# EasyEDA Pro project ProPrj_esp32s31-mp4_2026-09-21.epro, board PCB1
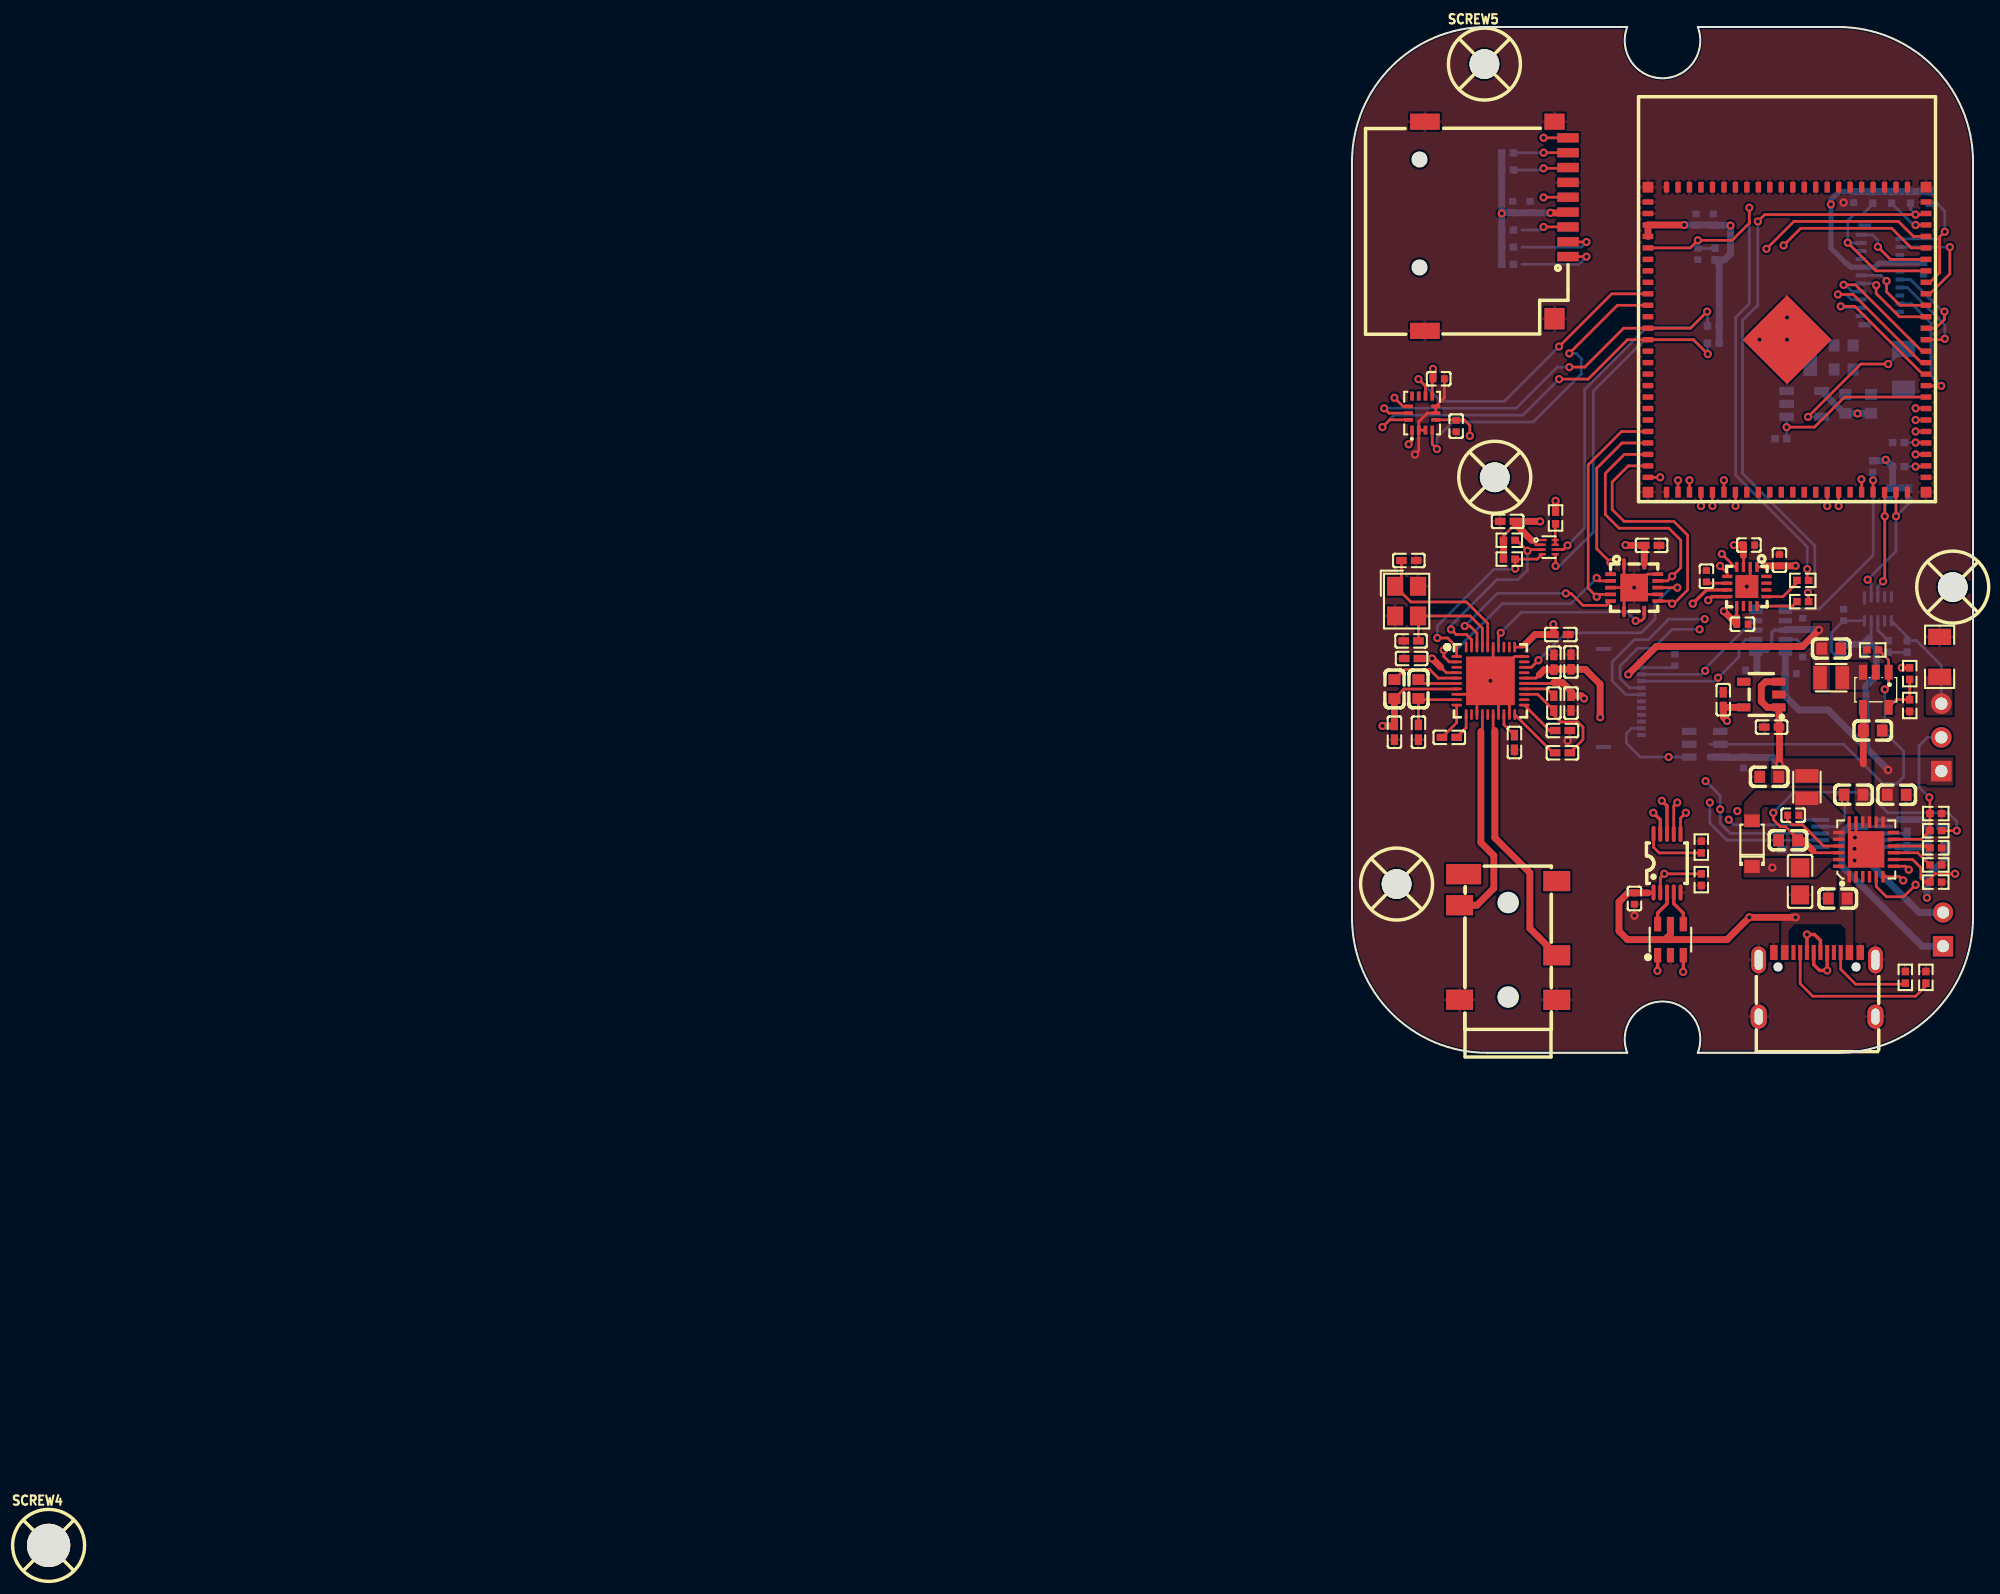
[diagram p10: board, top side]
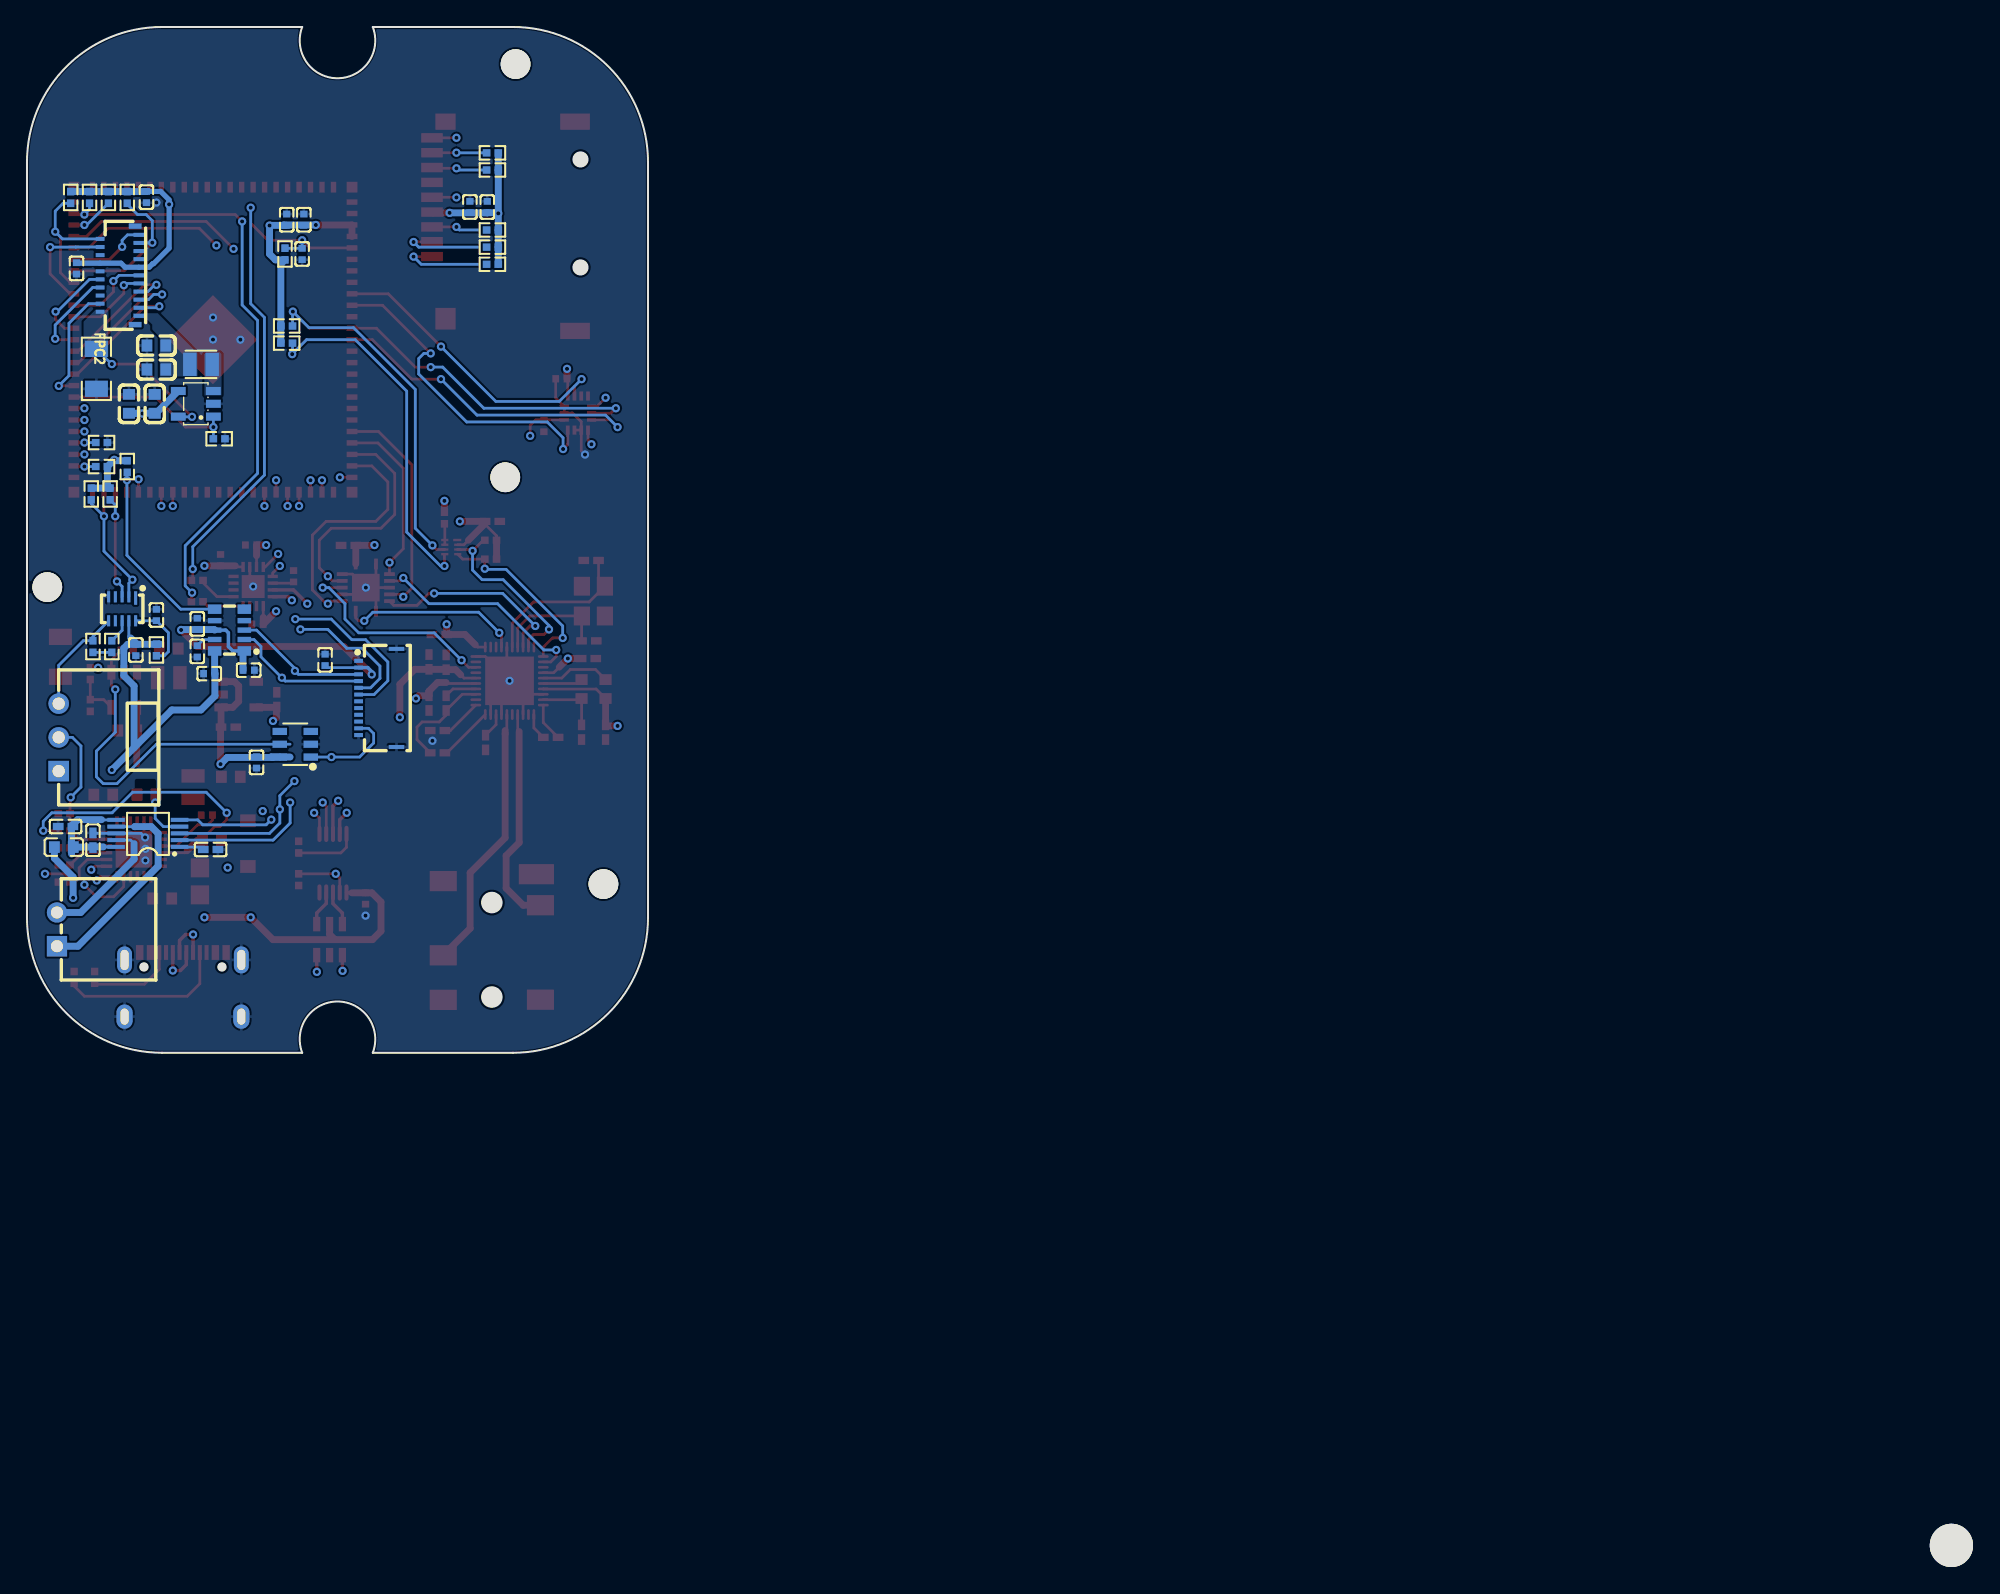
[diagram p11: board, bottom side, seen from below]

Outline 46 x 76 mm; copper layers: Top Layer, GND1, PWR, SINGAL, GND2, Bottom Layer. Coordinates in mm from the lower left corner of the outline.
Outline path: 0,66 arc(2.93,73.07) 10,76 20.38,76 arc(23,72.2) 25.62,76 36,76 arc(43.07,73.07) 46,66 46,10 arc(43.07,2.93) 36,0 25.62,0 arc(23,3.8) 20.38,0 10,0 arc(2.93,2.93) 0,10 0,66
Stack: Top Layer 0.035mm Outer layer thickness 1oz / Dielectric1 0.0994mm 3313 RC57% 4.2mil / GND1 0.035mm / Dielectric2 0.55mm 0.55mm H/H No copper / PWR 0.035mm / Dielectric3 0.1088mm 2116 RC54% 4.9mil / SINGAL 0.035mm / Dielectric4 0.55mm 0.55mm H/H No copper / GND2 0.035mm / Dielectric5 0.0994mm 3313 RC57% 4.2mil / Bottom Layer 0.035mm Outer layer thickness 1oz

## Design rules (mm)
net TYPEC_USB_DP_IN: USB1
net TYPEC_USB_DN_IN: USB1
net TYPEC_USB_DN: USB2
net TYPEC_USB_DP: USB2
net CH343P_USB_DP: USB3
net CH343P_USB_DN: USB3
spacing copperThickness1oz (default): track to track 0.102, other pairs 0.152 to 0.3
spacing copperThickness2oz: track to track 0.203, other pairs 0.152 to 0.3
track width copperThickness1oz (default): min 0.127, default 0.203, max 2.54
track width copperThickness2oz: min 0.203, default 0.254, max 2.54
track width power: min 0.127, default 0.508, max 2.54
differential pair differentialPair (default): width min 0.127, default 0.254, max 2.54; gap min 0.152, default 0.152
net GND uses copperRegion
net VBAT uses power
net VCC uses power
net VCC_3V3 uses power
net VCC_1V8 uses power
net VBUS_5V uses power
net VCC_LCD_BG uses power

## Placement (name value [footprint] x y rotation side)
C1  10uF  [C0603_1]  38.57 23.88 180 top
C2  10uF  [C0603_1]  35.5 29.95 180 top
C3  100nF  [C0402]  29 21.51 90 bottom
C4  1uF  [C0402_1]  32.4 15.06 0 bottom
C5  1uF  [C0402_1]  41.11 15.75 270 bottom
C6  100nF  [C0402]  29.58 28.35 180 bottom
C7  100nF  [C0402]  32.5 28.09 0 bottom
C8  22uF  [C0603]  3.14 26.95 270 top
C9  4.7uF  [C0603_1]  32.3 15.75 180 top
C10  10uF  [C0603_1]  40.35 19.12 180 top
C11  47nF  [C0402]  32.68 17.6 0 top
C12  10uF  [C0603_1]  30.9 20.45 0 top
C14  1uF  [C0603_1]  35.98 11.43 0 top
C15  10uF  [C0603_1]  37.15 19.12 0 top
C16  47uF  [C0805]  33.19 12.7 270 top
C17  2.2uF  [C0402_1]  3.14 23.75 270 top
C18  22uF  [C0603]  4.92 26.95 270 top
C19  2.2uF  [C0402_1]  4.92 23.75 270 top
C20  2.2uF  [C0402_1]  7.2 23.37 0 top
C21  2.2uF  [C0402_1]  15.59 23.88 0 top
C22  2.2uF  [C0402_1]  12.03 22.99 270 top
C23  2.2uF  [C0402_1]  16.22 25.91 90 top
C24  2.2uF  [C0402_1]  14.95 25.91 270 top
C25  2.2uF  [C0402_1]  15.59 22.22 0 top
C26  4.7uF  [C0402_1]  14.95 28.93 90 top
C27  100nF  [C0402_1]  15.46 30.99 0 top
C28  100nF  [C0402_1]  4.41 29.21 180 top
C29  100nF  [C0402_1]  16.22 28.96 90 top
C30  1uF  [C0402_1]  31.08 24.13 0 top
C31  1uF  [C0402_1]  27.5 26.16 270 top
C32  10pF  [C0402_1]  4.21 36.47 180 top
C33  10pF  [C0402_1]  4.37 30.52 180 top
C34  100nF  [C0402_1]  11.52 39.37 180 top
C35  100nF  [C0402_1]  22.19 37.59 180 top
C36  100nF  [C0402]  20.92 11.43 270 top
C37  100nF  [C0402]  31.66 36.5 90 top
C38  100nF  [C0402]  26.25 35.31 90 top
C39  1uF  [C0402]  25.62 59.18 270 bottom
C40  100nF  [C0402]  26.76 61.72 90 bottom
C41  1uF  [C0402]  25.49 61.72 90 bottom
C42  10uF  [C0603_1]  36.41 52.4 180 bottom
C43  220nF  [C0402]  37.94 29.84 270 bottom
C44  100nF  [C0402]  29.4 37.62 0 top
C45  100nF  [C0402]  42.33 58.11 270 bottom
C46  100nF  [C0402]  37.15 63.4 270 bottom
C47  100nF  [C0402]  7.71 46.43 270 top
C48  100nF  [C0402]  6.42 49.94 0 top
C49  10uF  [C0402]  11.9 62.66 270 bottom
C50  100nF  [C0402]  13.19 62.67 270 bottom
C51  100nF  [C0402]  28.92 31.75 0 top
C53  100nF  [C0402]  33.39 31.77 90 bottom
C54  1uF  [C0402]  33.39 29.74 270 bottom
C55  10uF  [C0603_1]  36.41 50.62 180 bottom
C56  10uF  [C0603_1]  38.45 48.08 270 bottom
C57  10uF  [C0603_1]  36.54 48.08 270 bottom
C58  100nF  [C0402_1]  43.15 16.76 180 bottom
C59  100nF  [C0402]  23.92 29.11 90 bottom
C61  220nF  [C0402]  36.41 32.44 90 bottom
CARD2  TF PUSH  [TF-SMD_TF-PUSH]  10.7 61.24 270 top
CN1  PJ-342B-TX-SMT  [AUDIO-SMD_PJ-342B-TX-SMT]  11.56 8.57 90 top
CN2  HX-XH2.54-3PWZ-B  [CONN-TH_3P-P2.50_BX-HA2.54-3PWZ]  43.65 23.37 90 bottom
CN3  HX-XH2.54-2PWZ-B  [CONN-TH_2P-P2.50_HX-XH2.54-2PWZ-B]  43.78 9.14 90 bottom
D1  USBLC6-2SC6  [SOT-23-6_L2.9-W1.6-P0.95-LS2.8-BL]  23.59 8.38 0 top
D2  B5817W  [SOD-123_L2.8-W1.8-LS3.7-RD]  29.63 15.49 90 top
FPC1  HC-FPC-05-10-12RLTAG  [FPC-SMD_12P-P0.50_HCTL_HC-FPC-05-10-12RLTAG]  20.03 26.29 270 bottom
FPC2  2.09寸320*375高清R角方屏QSPI  [CONN-TH-21P_AFE03-S21FMA-1H]  39.15 57.6 90 bottom
L1  2.2uH  [IND-SMD_L2.0-W1.6]  35.5 27.79 0 top
L2  2.2uH  [IND-SMD_L2.0-W1.6]  33.7 19.68 270 top
L3  BLM18KG601SN1D  [L0603]  43.27 15.24 0 bottom
L4  4.7uH  [IND-SMD_L2.0-W1.6]  33.11 51 180 bottom
R1  10mΩ  [R1206]  43.53 29.34 90 top
R2  1K  [R0402]  36.41 29.84 90 bottom
R3  22K1  [R0402]  41.31 25.73 90 top
R4  100K  [R0402]  41.31 28.09 90 top
R5  100K  [R0402]  38.57 29.84 0 top
R7  10K  [R0402]  39.84 41.4 270 bottom
R8  10K  [R0402]  41.24 41.4 270 bottom
R9  700R  [R0402]  43.24 15.19 180 top
R11  100K  [R0402]  43.24 13.91 180 top
R12  100K  [R0402]  43.24 12.64 180 top
R13  5K23  [R0402]  43.24 16.45 180 top
R14  30K1  [R0402]  43.24 17.72 180 top
R17  200K  [R0402_2]  15.08 39.62 90 top
R18  10K  [R0402_1]  11.65 37.97 180 top
R19  10K  [R0402_1]  11.65 36.58 180 top
R20  10K  [R0402]  41.37 63.37 270 bottom
R21  100K  [R0402]  25.87 15.24 270 top
R22  100K  [R0402]  25.87 12.83 270 top
R25  10K  [R0402]  39.97 63.37 270 bottom
R26  10K  [R0402]  26.76 53.85 180 bottom
R27  0/NC  [R0402]  33.39 35 0 top
R28  0/NC  [R0402]  33.39 33.43 180 top
R29  10K  [R0402]  26.89 59.18 270 bottom
R30  10K  [R0402]  26.76 52.58 180 bottom
R31  5K1  [R0402]  42.51 5.59 270 top
R32  5K1  [R0402]  40.99 5.59 270 top
R33  1K  [R0402]  39.72 30.1 270 bottom
R34  0R  [R0402]  41.11 30.1 270 bottom
R35  10K  [R0402]  11.52 66.67 0 bottom
R36  10K  [R0402]  11.52 58.42 0 bottom
R37  10K  [R0402]  11.52 59.69 0 bottom
R38  10K  [R0402]  11.52 65.4 0 bottom
R39  10K  [R0402]  11.52 60.96 0 bottom
R40  1R5  [R1206]  40.86 50.67 90 bottom
R41  100K  [R0402]  31.77 45.49 0 bottom
R42  10K  [R0402]  38.57 43.43 90 bottom
R43  10K  [R0402]  40.48 43.43 0 bottom
R44  10K  [R0402]  40.48 45.21 0 bottom
R45  10K  [R0402]  38.57 63.37 270 bottom
R46  10K  [R0402]  42.76 63.37 270 bottom
SCREW1  -  [M3螺丝]  3.3 12.5 0 top
SCREW2  -  [M3螺丝]  10.57 42.64 0 top
SCREW3  -  [M3螺丝]  44.5 34.5 0 top
SCREW4  -  [M3螺丝#2]  -96.56 -36.5 0 top
SCREW5  -  [M3螺丝]  9.81 73.25 0 top
U1  RX8130CE:BB  [RTC-SMD_L3.2-W2.5-P0.7-RX8130CE]  31 31.32 0 bottom
U2  CS43131-CNZ  [QFN-40_L5.0-W5.0-P0.40-TL-EP3.6_1]  10.25 27.56 0 top
U3  BQ25895RTW  [WQFN-24_L4.0-W4.0-P0.50-TL-EP2.7]  38.08 15.07 90 top
U4  TLV62568DBVR  [SOT-23-5_L3.0-W1.7-P0.95-LS2.8-BR]  38.8 26.9 90 top
U5  ME6211C18M5G-N  [SOT-23-5_L3.0-W1.7-P0.95-LS2.8-BR_1]  30.32 26.54 0 top
U6  GEK100  [SOT-23-6_L2.9-W1.6-P0.95-LS2.8-BL-2]  26.13 22.86 90 bottom
U7  PCA9306DQER  [X2SON-8_L1.4-W1.0-P0.35-BL]  14.57 37.46 270 top
U8  SN74LV4T125RGYR  [VQFN-14_L3.5-W3.5-P0.50-BL-EP]  20.9 34.46 270 top
U9  ESP32-S31-WROOM-3-N16R16V  [CONN-SMD_ESP32-S31-WROOM-3]  32.22 52.83 0 top
U11  DRV2605LDGSR  [VSSOP-10_L3.0-W3.0-P0.50-LS4.9-BL]  37.05 16.26 90 bottom
U12  CH343P  [TQFN-16_L3.0-W3.0-P0.50-BL-EP1.7]  29.25 34.54 180 top
U14  STC3115AIQT  [DFN-10_L3.0-W2.0-P0.50-BL]  38.95 32.89 0 bottom
U15  LSM6DS3TR-C  [LGA-14_L3.0-W2.5-P0.50-TL]  5.19 47.39 90 top
U16  PAM2804AAB010  [SOT-23-5_L3.0-W1.7-P0.95-LS2.8-BR]  33.49 48.08 180 bottom
U17  SGM7229YMS10G/TR  [MSOP-10_L3.0-W3.0-P0.50-LS4.9-BL]  23.33 14.05 0 top
USB1  TYPE-C 16PIN 2MD(073)  [USB-C-SMD_TYPE-C-16PIN-2MD-073]  34.45 5.05 0 top
X1  26MHz  [CRYSTAL-SMD_4P-L3.2-W2.5-BL_1]  4.04 33.46 270 top

## Footprints (pads in the part's own frame, mm; a bottom-side part is the same pattern mirrored in y, then rotated)
AUDIO-SMD_PJ-342B-TX-SMT
  rect 1.5x2 smd: 2(-4.645,3.6) 3(2.355,3.6) 5(-4.655,-3.6) 6(-1.355,-3.6) 7(4.145,-3.6)
  rect 1.5x2.6 smd: 4(4.655,3.3)
C0402
  rect 0.5x0.54 smd: 1(-0.42,0) 2(0.42,0)
C0402_1
  rect 0.79x0.54 smd: 1(-0.545,0) 2(0.545,0)
C0603
  rect 0.8x0.9 smd: 1(-0.7,0) 2(0.7,0)
C0603_1
  rect 0.8x0.9 smd: 1(-0.7,0) 2(0.7,0)
C0805
  rect 1.41x1.35 smd: 1(-1,0) 2(1,0)
CONN-SMD_ESP32-S31-WROOM-3
  rect 0.8x0.4 smd: 1(-10.3,10.2) 2(-10.3,9.35) 3(-10.3,8.5) 4(-10.3,7.65) 5(-10.3,6.8) 6(-10.3,5.95) 7(-10.3,5.1) 8(-10.3,4.25) 9(-10.3,3.4) 10(-10.3,2.55) 11(-10.3,1.7) 12(-10.3,0.85) 13(-10.3,0) 14(-10.3,-0.85) 15(-10.3,-1.7) 16(-10.3,-2.55) 17(-10.3,-3.4) 18(-10.3,-4.25) 19(-10.3,-5.1) 20(-10.3,-5.95) 21(-10.3,-6.8) 22(-10.3,-7.65) 23(-10.3,-8.5) 24(-10.3,-9.35) 25(-10.3,-10.2) 48(10.3,-10.2) 49(10.3,-9.35) 50(10.3,-8.5) 51(10.3,-7.65) 52(10.3,-6.8) 53(10.3,-5.95) 54(10.3,-5.1) 55(10.3,-4.25) 56(10.3,-3.4) 57(10.3,-2.55) 58(10.3,-1.7) 59(10.3,-0.85) 60(10.3,0) 61(10.3,0.85) 62(10.3,1.7) 63(10.3,2.55) 64(10.3,3.4) 65(10.3,4.25) 66(10.3,5.1) 67(10.3,5.95) 68(10.3,6.8) 69(10.3,7.65) 70(10.3,8.5) 71(10.3,9.35) 72(10.3,10.2)
  rect 0.4x0.8 smd: 26(-8.925,-11.3) 27(-8.075,-11.3) 28(-7.225,-11.3) 29(-6.375,-11.3) 30(-5.525,-11.3) 31(-4.675,-11.3) 32(-3.825,-11.3) 33(-2.975,-11.3) 34(-2.125,-11.3) 35(-1.275,-11.3) 36(-0.425,-11.3) 37(0.425,-11.3) 38(1.275,-11.3) 39(2.125,-11.3) 40(2.975,-11.3) 41(3.825,-11.3) 42(4.675,-11.3) 43(5.525,-11.3) 44(6.375,-11.3) 45(7.225,-11.3) 46(8.075,-11.3) 47(8.925,-11.3) 73(8.925,11.3) 74(8.075,11.3) 75(7.225,11.3) 76(6.375,11.3) 77(5.525,11.3) 78(4.675,11.3) 79(3.825,11.3) 80(2.975,11.3) 81(2.125,11.3) 82(1.275,11.3) 83(0.425,11.3) 84(-0.425,11.3) 85(-1.275,11.3) 86(-2.125,11.3) 87(-2.975,11.3) 88(-3.825,11.3) 89(-4.675,11.3) 90(-5.525,11.3) 91(-6.375,11.3) 92(-7.225,11.3) 93(-8.075,11.3) 94(-8.925,11.3)
  custom 6.604x6.604 smd: 95(0,3.302)
  rect 0.8x0.8 smd: 96(-10.3,-11.3) 97(10.3,-11.3) 98(10.3,11.3) 99(-10.3,11.3)
CONN-TH-21P_AFE03-S21FMA-1H
  rect 0.3x0.8 smd: 1(-3,-1.438) 3(-2.4,-1.438) 5(-1.8,-1.438) 7(-1.2,-1.438) 9(-0.6,-1.438) 11(0,-1.438) 13(0.6,-1.438) 15(1.2,-1.438) 17(1.8,-1.438) 19(2.4,-1.438) 21(3,-1.438)
  rect 0.3x0.65 smd: 2(-2.7,1.438) 4(-2.1,1.438) 6(-1.5,1.438) 8(-0.9,1.438) 10(-0.3,1.438) 12(0.3,1.438) 14(0.9,1.438) 16(1.5,1.438) 18(2.1,1.438) 20(2.7,1.438)
  rect 0.4x0.95 smd: 22(3.65,-1.163) 23(-3.65,-1.163)
CONN-TH_2P-P2.50_HX-XH2.54-2PWZ-B
  rect 1.524x1.5 hole 0.9: 1(-1.25,0)
  round 1.5 hole 0.9: 2(1.25,0)
CONN-TH_3P-P2.50_BX-HA2.54-3PWZ
  rect 1.524x1.524 hole 0.914: 1(-2.5,0)
  round 1.524 hole 0.914: 2(0,0) 3(2.5,0)
CRYSTAL-SMD_4P-L3.2-W2.5-BL_1
  rect 1.4x1.2 smd: 1(-1.1,-0.85) 2(1.1,-0.85) 3(1.1,0.85) 4(-1.1,0.85)
DFN-10_L3.0-W2.0-P0.50-BL
  rect 0.23x1 smd: 1(-1,-0.8)
  rect 0.23x0.825 smd: 2(-0.5,-0.887) 3(0,-0.887) 4(0.5,-0.887) 5(1,-0.887) 6(1,0.887) 7(0.5,0.887) 8(0,0.887) 9(-0.5,0.887) 10(-1,0.887)
FPC-SMD_12P-P0.50_HCTL_HC-FPC-05-10-12RLTAG
  rect 0.3x0.65 smd: 1(-2.75,-1.405) 2(-2.25,-1.405) 3(-1.75,-1.405) 4(-1.25,-1.405) 5(-0.75,-1.405) 6(-0.25,-1.405) 7(0.25,-1.405) 8(0.75,-1.405) 9(1.25,-1.405) 10(1.75,-1.405) 11(2.25,-1.405) 12(2.75,-1.405)
  rect 0.3x1.15 smd: 13(3.635,1.405) 14(-3.635,1.405)
IND-SMD_L2.0-W1.6
  rect 1x1.72 smd: 1(0.828,0) 2(-0.828,0)
L0603
  rect 0.8x0.864 smd: 1(-0.7,0) 2(0.7,0)
LGA-14_L3.0-W2.5-P0.50-TL
  rect 0.675x0.28 smd: 1(-1.262,0.75) 2(-1.262,0.25) 3(-1.262,-0.25) 4(-1.262,-0.75) 8(1.262,-0.75) 9(1.262,-0.25) 10(1.262,0.25) 11(1.262,0.75)
  rect 0.28x0.675 smd: 5(-0.5,-1.012) 6(0,-1.012) 7(0.5,-1.012) 12(0.5,1.012) 13(0,1.012) 14(-0.5,1.012)
M3螺丝
  round 2.2 hole 2.2: 1(0,0)
M3螺丝#2
  round 3.2 hole 3.2: 1(0,0)
MSOP-10_L3.0-W3.0-P0.50-LS4.9-BL
  oval 0.3x1.2 smd: 1(-1,-2.17) 2(-0.5,-2.17) 3(0,-2.17) 4(0.5,-2.17) 5(1,-2.17) 6(1,2.17) 7(0.5,2.17) 8(0,2.17) 9(-0.5,2.17) 10(-1,2.17)
QFN-40_L5.0-W5.0-P0.40-TL-EP3.6_1
  oval 0.8x0.2 smd: 1(-2.499,1.8) 2(-2.499,1.4) 3(-2.499,1) 4(-2.499,0.6) 5(-2.499,0.2) 6(-2.499,-0.2) 7(-2.499,-0.6) 8(-2.499,-1) 9(-2.499,-1.4) 10(-2.499,-1.8) 21(2.499,-1.8) 22(2.499,-1.4) 23(2.499,-1) 24(2.499,-0.6) 25(2.499,-0.2) 26(2.499,0.2) 27(2.499,0.6) 28(2.499,1) 29(2.499,1.4) 30(2.499,1.8)
  oval 0.2x0.8 smd: 11(-1.8,-2.499) 12(-1.4,-2.499) 13(-1,-2.499) 14(-0.6,-2.499) 15(-0.2,-2.499) 16(0.2,-2.499) 17(0.6,-2.499) 18(1,-2.499) 19(1.4,-2.499) 20(1.8,-2.499) 31(1.8,2.499) 32(1.4,2.499) 33(1,2.499) 34(0.6,2.499) 35(0.2,2.499) 36(-0.2,2.499) 37(-0.6,2.499) 38(-1,2.499) 39(-1.4,2.499) 40(-1.8,2.499)
  rect 3.6x3.6 smd: 41(0,0)
R0402
  rect 0.566x0.54 smd: 1(-0.433,0) 2(0.433,0)
R0402_1
  rect 0.566x0.54 smd: 1(-0.433,0) 2(0.433,0)
R0402_2
  rect 0.566x0.54 smd: 1(-0.433,0) 2(0.433,0)
R1206
  rect 1.208x1.701 smd: 1(-1.479,0) 2(1.479,0)
RTC-SMD_L3.2-W2.5-P0.7-RX8130CE
  rect 1x0.7 smd: 1(-1.1,1.55) 5(-1.1,-1.55) 6(1.1,-1.55) 10(1.1,1.55)
  rect 1x0.4 smd: 2(-1.1,0.7) 3(-1.1,0) 4(-1.1,-0.7) 7(1.1,-0.7) 8(1.1,0) 9(1.1,0.7)
SOD-123_L2.8-W1.8-LS3.7-RD
  rect 0.95x1.15 smd: 1(-1.692,0) 2(1.692,0)
SOT-23-5_L3.0-W1.7-P0.95-LS2.8-BR
  rect 1.1x0.6 smd: 1(1.3,-0.95) 2(1.3,0) 3(1.3,0.95) 4(-1.3,0.95) 5(-1.3,-0.95)
SOT-23-5_L3.0-W1.7-P0.95-LS2.8-BR_1
  rect 1x0.6 smd: 1(1.3,-0.95) 2(1.3,0) 3(1.3,0.95) 4(-1.3,0.95) 5(-1.3,-0.95)
SOT-23-6_L2.9-W1.6-P0.95-LS2.8-BL
  rect 0.532x1.072 smd: 1(-0.95,-1.149) 2(0,-1.149) 3(0.95,-1.149) 4(0.95,1.149) 5(0,1.149) 6(-0.95,1.149)
SOT-23-6_L2.9-W1.6-P0.95-LS2.8-BL-2
  rect 0.532x1.072 smd: 1(-0.95,-1.149) 2(0,-1.149) 3(0.95,-1.149) 4(0.95,1.149) 5(0,1.149) 6(-0.95,1.149)
TF-SMD_TF-PUSH
  rect 0.7x1.6 smd: 1(2.25,5.3) 2(1.15,5.3) 3(0.05,5.3) 4(-1.05,5.3) 5(-2.15,5.3) 6(-3.25,5.3) 7(-4.35,5.3) 8(-5.45,5.3) CD(-6.55,5.3)
  rect 1.2x1.5 smd: 10(-7.75,4.3)
  rect 1.2x2.2 smd: 11(-7.75,-5.3) 12(7.75,-5.3)
  rect 1.6x1.5 smd: 13(6.85,4.3)
TQFN-16_L3.0-W3.0-P0.50-BL-EP1.7
  rect 0.25x0.75 smd: 1(-0.749,-1.45) 2(-0.248,-1.45) 3(0.252,-1.45) 4(0.751,-1.45) 9(0.75,1.45) 10(0.25,1.45) 11(-0.25,1.45) 12(-0.749,1.45)
  rect 0.75x0.25 smd: 5(1.45,-0.75) 6(1.45,-0.25) 7(1.45,0.25) 8(1.45,0.75) 13(-1.45,0.75) 14(-1.45,0.25) 15(-1.45,-0.25) 16(-1.45,-0.75)
  rect 1.7x1.7 smd: 17(0.001,0)
USB-C-SMD_TYPE-C-16PIN-2MD-073
  oval 1.1x2 hole 0.6x1.5: 13(-4.325,1.825) 14(4.325,1.825)
  oval 1.2x1.8 hole 0.6x1.2: 13(-4.325,-2.375) 14(4.325,-2.375)
  rect 0.55x1.1 smd: A1B12(-3.2,2.375) A4B9(-2.4,2.375) B1A12(3.2,2.375) B4A9(2.4,2.375)
  rect 0.3x1.1 smd: A5(-1.25,2.375) A6(-0.25,2.375) A7(0.25,2.375) A8(1.25,2.375) B5(1.75,2.375) B6(0.75,2.375) B7(-0.75,2.375) B8(-1.75,2.375)
VQFN-14_L3.5-W3.5-P0.50-BL-EP
  rect 0.8x0.28 smd: 1(-1.75,-0.75) 7(1.75,-0.75) 8(1.75,0.75) 14(-1.75,0.75)
  rect 0.28x0.8 smd: 2(-0.999,-1.75) 3(-0.498,-1.75) 4(0.002,-1.75) 5(0.501,-1.75) 6(1.002,-1.75) 9(1,1.75) 10(0.5,1.75) 11(0,1.75) 12(-0.5,1.75) 13(-1,1.75)
  rect 2.05x2.05 smd: 15(0,0)
VSSOP-10_L3.0-W3.0-P0.50-LS4.9-BL
  rect 0.3x1.3 smd: 1(-1,-2.35) 2(-0.5,-2.35) 3(0,-2.35) 4(0.5,-2.35) 5(1,-2.35) 6(1,2.35) 7(0.5,2.35) 8(0,2.35) 9(-0.5,2.35) 10(-1,2.35)
WQFN-24_L4.0-W4.0-P0.50-TL-EP2.7
  rect 0.85x0.25 smd: 1(-2.025,1.25) 2(-2.025,0.75) 3(-2.025,0.25) 4(-2.025,-0.25) 5(-2.025,-0.75) 6(-2.025,-1.25) 13(2.025,-1.25) 14(2.025,-0.75) 15(2.025,-0.25) 16(2.025,0.25) 17(2.025,0.75) 18(2.025,1.25)
  rect 0.25x0.85 smd: 7(-1.25,-2.025) 8(-0.75,-2.025) 9(-0.25,-2.025) 10(0.25,-2.025) 11(0.75,-2.025) 12(1.25,-2.025) 19(1.25,2.025) 20(0.75,2.025) 21(0.25,2.025) 22(-0.25,2.025) 23(-0.75,2.025) 24(-1.25,2.025)
  rect 2.7x2.7 smd: 25(0.001,0)
X2SON-8_L1.4-W1.0-P0.35-BL
  rect 0.175x0.6 smd: 1(-0.525,-0.445)
  rect 0.175x0.53 smd: 2(-0.175,-0.48) 3(0.175,-0.48) 4(0.525,-0.48) 5(0.525,0.48) 6(0.175,0.48) 7(-0.175,0.48) 8(-0.525,0.48)

## Nets
As in the schematic, except:
$2N16: C9.1 R13.1 U3.22

Pads without a net: CN1 4 7; FPC1 7 8 9 10; FPC2 6 15 16 22 23; SCREW1 1; SCREW2 1; SCREW3 1; SCREW4 1; SCREW5 1; U1 4 5; U2 3 12 15 22 27 29 32 33 40; U5 4; U6 4; U9 6 7 8 33 34 35 36 37 38 39 91; U12 10 11 14 15 16; U14 4 7; U15 10 11; USB1 A8 B8

## Via types
v1: diameter 0.61, hole 0.305, Top Layer to Bottom Layer, 157 vias

## Routing (per net, layer and track width the routed paths; a pad name or vN(x,y) marks a point on that pad's centre or on a via; arc(x,y) is an arc through that point)
GND: length 41.9
  Top Layer w0.203: U2.13 9.25,26.56 U2.8 ; U8.13 21.9,35.46 v1(20.9,34.46) ; U8.1 20.15,35.21 v1(20.9,34.46) ; U3.17 37.33,16.03 v1(37.25,15.95) 36.83,16.37 U3.18 ; U8.7 20.15,33.71 20.9,34.46 U8.4 ; v1(20.9,34.46) 21.4,33.96 U8.10 ; 4.94,46.13 4.94,46.76 5.58,47.4 6.2,47.4 U15.6 U15.7 6.84,48.53 C48.2 ; 10.45,27.76 v1(10.25,27.56) ; 10.45,27.76 12.05,29.36 U2.30 ; 10.45,27.76 U2.35 ; U12.2 29.5,34.79 v1(29.25,34.54) ; v1(36.5,18.54) 36.5,19.06 C15.1 ; v1(4.66,44.32) 4.94,44.6 U15.2 U15.3 ; U2.17 10.85,26.96 11.65,26.16 U2.19
  Bottom Layer w0.203: U11.4 35.9,16.76 36.5,17.36 v1(36.5,18.54) ; C5.1 41.08,16.26 U11.8 37.56,16.26 v1(37.25,15.95)
  vias: v1(15.97,23.11) v1(20.92,10.16) v1(30.19,52.83) v1(32.22,54.48) v1(32.22,52.84) v1(36.41,62.99) v1(37.23,15.11) v1(37.23,14.25)
VBAT: length 25.7
  Top Layer w0.508: 39.66,20.93 39.69,20.93 v1(39.72,20.95)
  Bottom Layer w0.203: U14.9 38.45,30.87 38.32,30.73
  Bottom Layer w0.508: 38.06,22.61 38.06,27.18 38.83,27.94 38.83,29.97 38.53,30.26 C43.1 36.17,30.26 36.16,30.28 ; 38.06,22.61 v1(39.72,20.95) ; 38.06,22.61 35.27,25.4 33.11,25.4 32.08,26.43 C7.1 32.1,28.11 U1.10 ; 38.32,30.73 37.89,30.31
VBUS_5V: length 59.3
  Top Layer w0.203: 28.5,32.5 U12.9 ; U12.3 29,36.83
  Top Layer w0.254: 22.33,11.88 22.31,11.85 21.94,11.85
  Top Layer w0.508: 23.18,8.38 23.59,8.78 D1.5 ; 23.18,8.38 20.41,8.38 19.78,9.01 19.78,11.18 20.45,11.85 21.94,11.85 ; 23.18,8.38 27.78,8.38 v1(29.43,10.03) v1(32.86,10.03) ; v1(27.55,32.71) 27.55,32.7 C51.1 28.5,32.26 ; 29,36.83 29,37.58 ; C44.1 v1(28.29,37.62)
  PWR w0.508: v1(28.29,37.62) 28.07,37.84 26.75,37.84 26,37.08 26,35.94 27.55,34.39 v1(27.55,32.71) 27.55,29.31 33.11,23.75 33.11,20.7 29.43,17.02 v1(29.43,10.03)
VCC: length 41.5
  Top Layer w0.203: 13.87,28 13.63,27.76 U2.26
  Top Layer w0.508: v1(31.66,21.39) 31.66,24.09 C30.2 31.62,25.59 U5.1 30.76,25.59 30.32,26.03 30.32,27.18 30.63,27.49 U5.3 ; 37.87,21.4 C1.2 37.87,25.57 U4.4 ; 13.87,28 14.25,28.39 C26.1 14.98,28.41 C29.1 17.27,28.41 18.38,27.3 v1(18.38,24.85)
  PWR w0.508: v1(18.38,24.85) 22.35,24.85 25.82,21.39 v1(31.66,21.39)
  Bottom Layer w0.508: 27.78,21.88 31.17,21.88 v1(31.66,21.39) ; 26.51,21.91 27.88,21.91 27.91,21.93
VCC_1V8: length 100.7
  Top Layer w0.203: 14.95,27.43 14.95,27.36 U2.25 ; C8.2 3.84,26.95 7.74,26.95 U2.7 ; 13.3,37.97 13.63,37.64 U7.2 ; 6.57,28.57 6.99,28.16 U2.4 ; 12.79,30.23 12.62,30.06 U2.31 ; R18.2 11.22,38.3 12.07,39.15
  Top Layer w0.508: 21.65,37.54 U8.14 ; R18.2 R19.2 ; v1(27.78,24.59) 27.52,24.84 27.52,25.59 ; v1(14.91,31.75) C27.1 13.55,30.99 12.79,30.23 ; v1(2.25,24.22) 3.06,24.22 C17.1 C8.2 ; 27.52,25.59 U5.5 ; 27.52,25.59 C31.2 ; v1(13.94,39.37) 12.07,39.37 12.07,39.21 13.3,37.97 ; C35.2 20.28,37.59 v1(20.26,37.62) ; v1(17.19,26.25) 16.98,26.45 C23.2 16.22,26.8 15.59,27.43 14.95,27.43 ; 4.96,29.21 v1(5.93,29.21) 6.57,28.57
  PWR w0.508: v1(17.19,26.25) 14.91,28.52 v1(14.91,31.75) ; v1(17.19,26.25) 26.12,26.25 v1(27.78,24.59) ; v1(17.19,26.25) 15.15,24.22 v1(2.25,24.22) 5.93,27.9 v1(5.93,29.21) 3.27,31.88 3.27,36.83 5.81,39.37 v1(13.94,39.37) 18.51,39.37 v1(20.26,37.62)
VCC_3V3: length 211.7
  Top Layer w0.203: v1(4.19,45.08) 4.44,45.34 U15.1 ; U15.8 5.94,49.81 ; v1(8.73,45.71) 8.73,46.48 8.31,46.89 7.67,46.89 ; 7.67,46.89 U15.5 ; 7.67,46.89 C47.1 ; U12.1 30.44,35.99 ; v1(3.14,48.53) 3.78,47.89 U15.12
  Top Layer w0.254: 41.31,28.52 v1(40.73,28.52)
  Top Layer w0.508: 30.57,36.08 C37.1 v1(32.86,36.08) ; v1(15.08,40.89) R17.2 ; v1(24.6,61.33) U9.3 U9.4 ; v1(20.46,28.03) 22.53,30.1 33.36,30.1 v1(34.59,31.32) ; C48.1 v1(6,50.67) ; CARD2.4 15.94,62.23 v1(14.7,62.23)
  PWR w0.203: v1(34.59,31.32) 37.39,28.52 v1(40.73,28.52) ; v1(4.19,45.08) 4.82,45.72 8.72,45.72 v1(8.73,45.71) ; v1(3.14,48.53) 5.44,48.53 6,49.08 v1(6,50.67)
  PWR w0.508: v1(15.08,40.89) 15.08,48.51 11.09,52.5 ; 9.26,50.67 11.09,52.5 ; 9.26,50.67 8.73,50.14 v1(8.73,45.71) ; 9.26,50.67 v1(6,50.67) ; 11.09,52.5 v1(11.09,62.19) 11.09,63.32 12.03,64.26 25.06,64.26 ; v1(34.59,31.32) 32.86,33.05 v1(32.86,36.08) 37.8,41.02 38.95,41.02 39.53,41.6 v1(39.53,43.93) 34.76,48.7 34.76,62.15 v1(35.47,62.86) 34.07,64.26 25.06,64.26 ; 25.06,64.26 v1(28.03,61.29)
  Bottom Layer w0.203: C59.1 23.77,28.54 21.44,28.54 FPC1.2
  Bottom Layer w0.254: U1.8 31.28,31.32 31.08,31.11 31.08,30.1 30.75,29.77 U1.1 ; FPC1.2 20.76,28.54 20.46,28.24 v1(20.46,28.03)
  Bottom Layer w0.381: 42.23,58.56 42.17,58.5 FPC2.14 39.03,58.5 38.73,58.2 FPC2.13 36.95,58.2 36.69,58.46 36.63,58.46 35.47,59.61 v1(35.47,62.86) 35.47,63.19 36.1,63.82 C46.1
  Bottom Layer w0.508: R42.2 39.61,43.87 R43.1 40.05,42.04 R7.1 R8.1 ; R36.1 R37.1 R39.1 v1(11.09,62.19) ; U1.8 32.14,31.35 C53.1 34.56,31.35 v1(34.59,31.32) ; 27.02,61.3 26.99,61.33 v1(24.6,61.33) ; 27.02,61.3 C40.1 ; 27.02,61.3 28.02,61.3 v1(28.03,61.29) 28.03,59.18 27.6,58.75 R29.2 27.19,58.44 R26.1 R30.1 ; R35.1 R38.1 v1(11.09,62.19) ; R46.1 R20.1 R25.1 R45.1 37.16,63.81 C46.1 ; C6.1 30,29.67 U1.1 ; v1(11.09,62.19) 11.14,62.24 11.9,62.24 11.91,62.23 v1(14.7,62.23)
VCC_LCD_BG: length 60.2
  PWR w0.508: v1(31.14,13.72) 33.37,11.48 v1(42.59,11.48) 42.76,11.66 42.76,15.87 41.49,17.14 41.49,40 40.73,40.77 40.73,44.08 v1(37.45,47.36)
  Bottom Layer w0.508: L3.2 43.97,14.42 42.59,13.03 v1(42.59,11.48) ; U16.4 36.44,47.38 C57.2 C56.2 38.43,47.36 v1(37.45,47.36)
BAT_TS: length 11.5
  Top Layer w0.203: U3.11 42.17,15.82 R13.2 R14.2 42.81,18.88 v1(42.76,18.92)
  Bottom Layer w0.203: v1(42.76,18.92) 42,19.68 42,22.73 42.64,23.37 CN2.2
BQ25895_CHG_EN#: length 3.1
  Top Layer w0.203: R11.2 41.91,14.82 U3.9
BQ25895_I2C_CLK: length 82.6
  Top Layer w0.203: v1(39.34,34.92) 39.46,35.05 v1(39.46,39.75) 39.46,41.52 U9.45 ; U3.5 38.83,12.31 39.59,11.56 40.86,11.56 v1(41.75,12.45)
  SINGAL w0.203: v1(41.75,12.45) 40.61,11.3 29.43,11.3 26.51,14.22 v1(26.51,18.54) 27.12,19.15 v1(27.12,27.79) 36.64,27.79 39.34,30.48 v1(39.34,34.92)
  Bottom Layer w0.203: v1(26.51,18.54) 26.51,17.02 27.77,15.76 U11.2 ; U14.3 38.95,34.54 v1(39.34,34.92) ; R7.2 39.46,40.59 v1(39.46,39.75) ; U1.2 29.18,30.62 28.67,30.1 28.67,29.34 v1(27.12,27.79) 26.87,27.54 FPC1.4
BQ25895_I2C_SDA: length 78.3
  Top Layer w0.203: U3.6 40.55,13.04 v1(40.83,12.77) ; U9.46 v1(40.3,39.75)
  SINGAL w0.203: v1(27.27,18.03) 27.27,14.35 29.81,11.81 39.87,11.81 v1(40.83,12.77) ; v1(38.19,35.05) 38.83,34.42 38.83,30.86 36.41,28.45 26.31,28.45 v1(26.15,28.3) 26.19,28.26 v1(26.19,20.13)
  Bottom Layer w0.203: FPC1.3 21.44,28.03 25.89,28.03 v1(26.15,28.3) 26.15,28.47 29,31.32 U1.3 ; v1(26.19,20.13) 27.27,19.05 v1(27.27,18.03) 27.27,17.02 28.03,16.26 U11.3 ; U14.2 38.45,34.79 v1(38.19,35.05) 40.3,37.16 v1(40.3,39.75) 41.24,40.69 R8.2
BQ25895_INT: length 53.6
  Top Layer w0.203: U3.7 40.98,13.82 v1(41.24,13.56) ; v1(41.75,43.43) 42.47,43.43 U9.49
  SINGAL w0.203: v1(41.75,43.43) 41.75,31.24 37.18,26.67 34,26.67 28.54,21.21 v1(28.54,17.91) 28.54,13.97 30.19,12.32 39.21,12.32 40.45,13.56 v1(41.24,13.56)
  Bottom Layer w0.203: R43.2 v1(41.75,43.43)
BQ25895_OTG_EN: length 61.9
  Top Layer w0.203: U9.50 v1(41.75,44.33) ; U3.8 41.53,14.32 42.14,13.71 42.14,12.95 42.44,12.64 R12.2 42.81,12.87 43.2,13.26 v1(44.67,13.26)
  SINGAL w0.203: v1(41.75,44.33) 41.99,44.33 42.38,43.94 42.38,31.11 37.3,26.03 34.25,26.03 29.18,20.95 29.18,14.1 30.44,12.83 38.83,12.83 40.35,14.35 43.58,14.35 v1(44.67,13.26)
CH343P_UART_DTR: length 3.1
  Top Layer w0.203: U12.12 32.62,33.09 R28.2
CH343P_UART_RTS: length 2.7
  Top Layer w0.203: 32.96,34.82 31.93,33.79 U12.13
CH343P_UART_RX: length 41.8
  Top Layer w0.203: v1(27.27,36.07) 27.8,35.54 U12.5 ; v1(31.97,59.82) 33.24,61.09 39.97,61.09 41.43,59.63 U9.68
  SINGAL w0.203: v1(31.97,59.82) 28.29,56.13 28.29,45.97 30.83,43.43 30.83,37.34 29.56,36.07 v1(27.27,36.07)
CH343P_UART_TX: length 42.4
  Top Layer w0.203: 28.5,35.99 28.36,35.99 v1(27.4,36.96) ; U9.69 41.59,60.48 40.48,61.59 32.73,61.59 v1(30.7,59.56)
  SINGAL w0.203: v1(30.7,59.56) 27.78,56.64 27.78,45.85 30.32,43.31 30.32,37.59 29.3,36.58 27.78,36.58 v1(27.4,36.96)
CH343P_USB_DN: length 20.6
  Top Layer w0.254: U17.8 23.33,18.29 v1(22.95,18.67) ; v1(26.38,33.53) 26.65,33.79 U12.8
  SINGAL w0.254: v1(26.38,33.53) 22.7,29.84 22.7,18.92 v1(22.95,18.67)
CH343P_USB_DP: length 21.7
  Top Layer w0.254: v1(22.32,17.78) 22.83,17.26 U17.9 ; v1(25.24,33.27) 26.26,34.29 U12.7
  SINGAL w0.254: v1(22.32,17.78) 22.06,18.03 22.06,30.1 v1(25.24,33.27)
CS43131_I2S_LRCK: length 14.5
  Top Layer w0.203: U8.6 18.83,33.15 17.11,33.15 16.22,34.04 v1(15.84,34.04) ; U2.38 9.25,31.1 8.73,31.62 v1(8.35,31.62)
  Bottom Layer w0.203: v1(8.35,31.62) 10.76,34.04 v1(15.84,34.04)
CS43131_I2S_SCLK: length 13.2
  Top Layer w0.203: U8.8 21.65,32.22 21.43,32 v1(21.01,32) ; U2.34 10.85,30.95 v1(11.01,31.11)
  Bottom Layer w0.203: v1(11.01,31.11) 12.54,32.64 20.38,32.64 v1(21.01,32)
CS43131_I2S_SDIN: length 16.3
  Top Layer w0.203: U2.2 7.2,28.96 6.8,29.36 v1(6.8,29.84) ; v1(18.13,35.18) 18.34,34.96 U8.3
  Bottom Layer w0.203: v1(6.8,29.84) 7.71,29.84 11.14,33.27 16.22,33.27 v1(18.13,35.18)
CS43131_RST#_1V8: length 15.9
  Top Layer w0.203: U2.28 13.28,28.56 v1(13.81,29.08) ; U8.11 v1(24.09,34.46)
  Bottom Layer w0.203: v1(13.81,29.08) 15.84,31.11 21.43,31.11 22.44,32.13 22.44,33.27 23.63,34.46 v1(24.09,34.46)
CS43131_SCL_1V8: length 13.8
  Top Layer w0.203: U7.3 14.08,37.28 13.09,37.28 v1(12.99,37.19) 12.21,37.97 R18.1 ; U2.39 8.85,30.61 8.47,30.99 7.71,30.99 v1(7.33,31.37)
  Bottom Layer w0.203: v1(12.99,37.19) 12.99,35.76 12.28,35.05 10.73,35.05 7.33,31.66 v1(7.33,31.37)
CS43131_SDA_1V8: length 13.7
  Top Layer w0.203: U2.1 7.75,30.06 7.08,30.73 v1(6.31,30.73) ; U7.4 13.73,36.58 R19.1 12.09,36.57 v1(12.09,35.86)
  Bottom Layer w0.203: v1(12.09,35.86) 12.04,35.81 10.51,35.81 6.31,31.62 v1(6.31,30.73)
DAC_I2C_SCL: length 54.5
  Top Layer w0.203: v1(16.09,50.8) 17.24,50.8 20.12,53.68 U9.12 25.07,53.68 v1(26.31,54.91) ; v1(2.38,47.75) 2.74,47.39 U15.13 ; U7.6 15.66,37.29 v1(15.97,37.59)
  Bottom Layer w0.203: v1(2.38,47.75) 12.16,47.75 15.21,50.8 v1(16.09,50.8) ; v1(15.97,37.59) 17.24,38.86 17.24,49.15 21.81,53.72 25.11,53.72 v1(26.31,54.91) 26.33,54.89 R26.2
DAC_I2C_SDA: length 55.8
  Top Layer w0.203: v1(15.33,49.91) 17.49,49.91 20.41,52.83 U9.13 25.29,52.83 v1(26.36,51.76) ; U15.14 2.79,46.89 v1(2.25,46.35) ; 15.08,36.91 v1(15.08,36.07)
  Bottom Layer w0.203: 26.33,51.79 25.29,52.83 21.68,52.83 17.87,49.02 17.87,38.57 15.37,36.07 v1(15.08,36.07) ; 26.33,51.79 R30.2 ; 26.33,51.79 v1(26.36,51.76) ; v1(2.25,46.35) 3.14,47.24 12.66,47.24 v1(15.33,49.91)
DAC_I2S_LRCK: length 16.6
  Top Layer w0.203: U8.5 18.31,33.96 v1(18.13,33.78) 17.49,34.42 17.49,43.56 19.96,46.03 U9.21
DAC_I2S_SCLK: length 18.3
  Top Layer w0.203: U8.9 23.52,33.46 v1(23.71,33.27) 23.84,33.27 24.86,34.29 24.86,38.35 23.84,39.37 20.16,39.37 19.27,40.26 19.27,42.29 20.46,43.48 U9.24
DAC_I2S_SDIN: length 12.8
  Top Layer w0.203: U8.2 v1(19.15,36.32) 18.13,37.34 18.13,43.31 20,45.18 U9.22
DAC_RST#: length 17.3
  Top Layer w0.203: U8.12 23.37,34.96 v1(23.71,35.31) 24.35,35.94 24.35,37.97 23.46,38.86 19.78,38.86 18.76,39.88 18.76,42.93 20.17,44.33 U9.23
ESP32S31_EN: length 41.7
  Top Layer w0.203: v1(29.43,62.61) 29.43,61.47 28.16,60.2 v1(25.62,60.2) 25.05,59.63 U9.5 ; 33.82,34.82 33.72,34.92 v1(33.72,35.84)
  Bottom Layer w0.203: R29.1 26.88,59.6 C39.1 v1(25.62,60.2) ; v1(29.43,62.61) 29.43,55.5 28.41,54.48 28.41,42.8 33.72,37.49 v1(33.72,35.84)
ESP_BOOT1: length 44.8
  Top Layer w0.203: U9.71 42.44,62.1 v1(41.75,62.1) 30.57,62.1 v1(30.06,61.59) ; v1(33.77,34.09) 33.82,34.04 33.82,33.43
  Bottom Layer w0.203: v1(33.77,34.09) 34.28,34.59 34.28,37.57 28.92,42.93 28.92,54.26 30.06,55.4 v1(30.06,61.59) ; v1(41.75,62.1) 41.37,62.48 R20.2
ESP_BOOT2: length 3.2
  Top Layer w0.203: U9.70 v1(41.75,61.33)
  Bottom Layer w0.203: R25.2 41.58,61.33 v1(41.75,61.33)
ESP_I2C2_SCL: length 11.7
  Top Layer w0.203: U9.66 38.81,57.93 v1(36.72,60.02)
  Bottom Layer w0.203: FPC2.19 36.74,60 v1(36.72,60.02) 36.72,61.65 37.18,62.1 37.81,62.1 38.57,62.86 R45.2
ESP_I2C2_SDA: length 10.9
  Top Layer w0.203: U9.65 42.81,57.08 43.53,57.8 43.53,60.45 v1(43.91,60.83)
  Bottom Layer w0.203: v1(43.91,60.83) 43.37,60.3 FPC2.20 ; R46.2 43.32,62.94 43.91,62.36 43.91,60.87
ESP_IO1: length 22.5
  Top Layer w0.203: v1(4.92,49.91) 5.44,49.39 U15.9 ; 21.92,56.23 19.24,56.23 v1(15.33,52.32)
  Bottom Layer w0.203: v1(15.33,52.32) 11.27,48.26 6.57,48.26 v1(4.92,49.91)
ESP_IO4: length 24.5
  Top Layer w0.203: U9.10 19.66,55.38 v1(16.09,51.82) ; v1(6.29,44.73) 5.94,45.08 U15.4
  Bottom Layer w0.203: v1(6.29,44.73) 6.29,45.56 7.46,46.74 13.43,46.74 16.98,50.29 16.98,51.43 16.6,51.82 v1(16.09,51.82)
ESP_IO19: length 34
  Top Layer w0.203: v1(14.19,67.79) 14.19,67.79 CARD2.CD ; U9.25 v1(22.83,42.63)
  SINGAL w0.203: v1(14.19,67.79) 13.53,67.79 12.79,67.06 12.79,65.53 13.94,64.39 15.59,64.39 22.83,57.15 v1(22.83,42.63)
ESP_IO34: length 47
  Top Layer w0.203: v1(37.74,42.49) 37.75,42.48 U9.43 ; R22.1 v1(23.13,13.26) 22.83,12.96 22.83,11.88
  SINGAL w0.203: v1(23.13,13.26) 24.02,13.26 25.49,14.73 25.49,28.57 25.87,28.96 36.03,28.96 37.53,30.45 37.53,42.29 v1(37.74,42.49)
ESP_IO35: length 15.2
  Top Layer w0.203: U9.44 v1(38.6,42.42)
  Bottom Layer w0.203: U1.6 34.61,32.87 38.6,36.85 v1(38.6,42.42) 38.6,42.98 R42.1
ESP_IO40: length 44.5
  Top Layer w0.203: v1(41.75,45.21) 42.49,45.21 U9.51
  SINGAL w0.203: v1(27.91,17.27) 27.91,21.46 33.75,27.3 37.05,27.3 41.11,31.37 41.11,44.83 41.49,45.21 v1(41.75,45.21)
  Bottom Layer w0.203: R44.2 v1(41.75,45.21) ; U11.5 33.35,17.26 32.99,16.89 28.29,16.89 v1(27.91,17.27)
ESP_IO42: length 48.1
  Top Layer w0.203: U9.52 v1(41.75,46.03)
  SINGAL w0.203: v1(41.75,46.03) 39.52,46.03 34.38,40.89 34.38,39.88 35.91,38.35 35.91,31.11 35.27,30.48 24.98,30.48 23.45,28.95 v1(23.45,21.91)
  Bottom Layer w0.203: 24.98,21.91 v1(23.45,21.91) 21.36,21.91 20.32,22.95 20.32,23.66 20.7,24.04 FPC1.11
ESP_IO43: length 40
  Top Layer w0.203: U9.53 v1(41.75,46.88)
  SINGAL w0.203: v1(25.75,31.37) 26.13,30.99 32.99,30.99 35.4,33.4 35.4,38.1 33.87,39.62 33.87,41.15 39.61,46.88 v1(41.75,46.88)
  Bottom Layer w0.203: v1(25.75,31.37) 23.71,31.37 22.32,29.97 21.17,29.97 19.85,28.65 19.85,27.74 20.55,27.04 FPC1.5
ESP_IO44: length 42.3
  Top Layer w0.203: v1(41.75,47.75) 42.5,47.75 42.52,47.73
  SINGAL w0.203: v1(41.75,47.75) 39.59,47.75 33.37,41.53 33.37,39.37 34.89,37.85 34.89,33.78 32.6,31.5 26.76,31.5 v1(26.13,32.13)
  Bottom Layer w0.203: v1(26.13,32.13) 23.46,32.13 21.94,30.61 20.92,30.61 19.27,28.96 19.27,27.56 20.29,26.54 FPC1.6
ESP_IO45: length 13
  Top Layer w0.203: v1(32.19,46.35) 34.25,46.35 36.48,48.58 U9.55
  Bottom Layer w0.203: 32.17,45.41 32.19,45.43 v1(32.19,46.35) U16.1
ESP_IO46: length 9
  Top Layer w0.203: U9.56 42.55,49.41 v1(43.65,49.41)
  Bottom Layer w0.203: v1(43.65,49.41) 42.89,50.16 42.89,54.05 41.44,55.5 FPC2.4
ESP_IO47: length 10
  Top Layer w0.203: U9.57 42.27,50.28 37.24,55.3 v1(36.2,55.3)
  Bottom Layer w0.203: v1(36.2,55.3) 36.31,55.2 FPC2.3
ESP_IO54: length 8.1
  Top Layer w0.203: v1(44.29,59.69) 44.29,57.71 42.81,56.23 42.52,56.23
  Bottom Layer w0.203: v1(44.29,59.69) 42.38,59.69 42.37,59.7 FPC2.18
ESP_IO57: length 5.9
  Top Layer w0.203: v1(38.95,59.71) 39.88,58.78 U9.67
  Bottom Layer w0.203: FPC2.21 38.55,60.6 38.95,60.2 v1(38.95,59.71)
ESP_SPI2_CLK: length 10.5
  Top Layer w0.203: U9.58 42.18,51.13 37.12,56.19 v1(35.99,56.19)
  Bottom Layer w0.203: v1(35.99,56.19) 36.62,56.19 37,55.8 FPC2.5
ESP_SPI2_CS: length 9.6
  Top Layer w0.203: v1(36.41,56.9) 37.3,56.9 42.22,51.98 U9.59
  Bottom Layer w0.203: FPC2.7 37.04,56.4 36.54,56.9 v1(36.41,56.9)
ESP_SPI2_D0: length 6.2
  Top Layer w0.203: v1(39.6,57.18) 39.6,56.38 40.59,55.38 U9.63
  Bottom Layer w0.203: v1(39.6,57.18) 39.18,57.6 FPC2.11
ESP_SPI2_D1: length 6.5
  Top Layer w0.203: U9.61 43.23,53.68 43.88,54.33 v1(43.88,54.91)
  Bottom Layer w0.203: v1(43.88,54.91) 43.75,54.91 41.37,57.3 FPC2.10
ESP_SPI2_D2: length 6.2
  Top Layer w0.203: U9.62 40.56,54.53 38.83,56.26 v1(38.83,56.87)
  Bottom Layer w0.203: FPC2.9 38.7,57 v1(38.83,56.87)
ESP_SPI2_D3: length 6.9
  Top Layer w0.203: v1(43.91,52.9) 43.85,52.83 U9.60
  Bottom Layer w0.203: v1(43.91,52.9) 43.91,53.92 41.13,56.7 FPC2.8
ESP_TF_CLK: length 42.7
  Top Layer w0.203: v1(14.19,63.37) 14.2,63.39 CARD2.5 ; U9.31 v1(27.55,42.42)
  SINGAL w0.203: v1(14.19,63.37) 13.3,62.48 13.3,60.07 17.24,56.13 17.24,43.56 22.19,38.61 27.78,38.61 29.18,40 29.18,41.78 28.54,42.42 v1(27.55,42.42)
ESP_TF_CMD: length 44.2
  Top Layer w0.203: v1(28.41,40.51) 28.41,41.52 U9.32 ; CARD2.3 v1(14.19,61.19)
  SINGAL w0.203: v1(14.19,61.19) 14.19,60.2 18.25,56.13 18.25,49.03 arc(18.33,48.85) 18.51,48.77 19.52,48.77 arc(19.78,48.52) 19.52,48.27 18.51,48.27 arc(18.25,48.01) 18.51,47.76 19.52,47.76 arc(19.78,47.5) 19.52,47.25 18.51,47.25 arc(18.25,47) 18.51,46.74 19.52,46.74 arc(19.78,46.49) 19.52,46.23 18.51,46.23 arc(18.33,46.16) 18.25,45.98 18.25,43.43 22.44,39.24 27.14,39.24 v1(28.41,40.51)
  Bottom Layer w0.203: v1(14.19,61.19) 13.96,60.96 12.59,60.96
ESP_TF_DAT0: length 45
  Top Layer w0.203: CARD2.7 15.94,65.53 v1(14.19,65.53) ; U9.27 v1(24.15,42.42)
  SINGAL w0.203: v1(24.15,42.42) 24.15,56.97 20.26,60.86 arc(20.19,61.04) 20.26,61.22 20.77,61.73 arc(20.77,62.09) 20.41,62.08 19.9,61.58 arc(19.54,61.58) 19.54,61.94 20.05,62.44 arc(20.05,62.8) 19.69,62.8 19.18,62.3 arc(18.82,62.3) 18.82,62.65 19.33,63.16 arc(19.33,63.52) 18.97,63.52 18.46,63.01 arc(18.1,63.01) 18.1,63.37 18.61,63.88 arc(18.61,64.24) 18.25,64.24 17.75,63.73 arc(17.39,63.73) 17.39,64.09 17.89,64.6 arc(17.89,64.96) 17.53,64.96 17.03,64.45 arc(16.67,64.45) 16.67,64.81 17.18,65.32 arc(17.17,65.68) 16.82,65.68 16.31,65.17 arc(16.13,65.09) 15.95,65.17 15.59,65.53 v1(14.19,65.53)
  Bottom Layer w0.203: 12.08,65.4 14.06,65.4 v1(14.19,65.53)
ESP_TF_DAT1: length 45.2
  Top Layer w0.203: CARD2.8 v1(14.19,66.69) ; U9.28 v1(25,42.42)
  SINGAL w0.203: v1(25,42.42) 25,59.04 24.71,59.33 arc(24.53,59.4) 24.35,59.33 23.7,58.67 arc(23.34,58.67) 23.34,59.03 24,59.68 arc(24,60.04) 23.64,60.04 22.98,59.39 arc(22.62,59.39) 22.62,59.75 23.28,60.4 arc(23.28,60.76) 22.92,60.76 22.26,60.11 arc(21.9,60.11) 21.9,60.46 22.56,61.12 arc(22.56,61.48) 22.2,61.48 21.54,60.82 arc(21.18,60.82) 21.18,61.18 21.84,61.84 arc(21.91,62.02) 21.84,62.2 17.35,66.69 v1(14.19,66.69)
  Bottom Layer w0.203: v1(14.19,66.69) 14.18,66.67 12.08,66.67
ESP_TF_DAT2: length 47.8
  Top Layer w0.203: CARD2.1 v1(17.36,58.99) ; U9.29 v1(25.85,40.51)
  SINGAL w0.203: v1(17.36,58.99) 21.05,55.3 21.05,52.77 arc(21.12,52.59) 21.3,52.52 22.06,52.52 arc(22.32,52.26) 22.06,52.01 21.3,52.01 arc(21.05,51.75) 21.3,51.5 22.06,51.5 arc(22.32,51.25) 22.06,50.99 21.3,50.99 arc(21.05,50.74) 21.3,50.48 22.06,50.48 arc(22.32,50.23) 22.06,49.98 21.3,49.98 arc(21.05,49.72) 21.3,49.47 22.06,49.47 arc(22.32,49.21) 22.06,48.96 21.3,48.96 arc(21.05,48.71) 21.3,48.45 22.06,48.45 arc(22.32,48.2) 22.06,47.94 21.3,47.94 arc(21.05,47.69) 21.3,47.44 22.06,47.44 arc(22.32,47.18) 22.06,46.93 21.3,46.93 arc(21.05,46.67) 21.3,46.42 22.06,46.42 arc(22.32,46.17) 22.06,45.91 21.3,45.91 arc(21.05,45.66) 21.3,45.4 22.06,45.4 arc(22.32,45.15) 22.06,44.9 21.3,44.9 arc(21.12,44.82) 21.05,44.64 21.05,42.54 23.08,40.51 v1(25.85,40.51)
  Bottom Layer w0.203: 12.59,58.42 16.8,58.42 v1(17.36,58.99)
ESP_TF_DAT3: length 47.8
  Top Layer w0.203: CARD2.2 16.02,60.07 v1(17.36,60.07) ; U9.30 v1(26.7,40.51)
  SINGAL w0.203: v1(26.7,40.51) 26.7,40.19 26.38,39.88 22.7,39.88 20.41,42.16 20.41,49.46 arc(20.34,49.64) 20.16,49.72 19.14,49.72 arc(18.89,49.97) 19.14,50.22 20.16,50.22 arc(20.41,50.48) 20.16,50.73 19.14,50.73 arc(18.89,50.99) 19.14,51.24 20.16,51.24 arc(20.41,51.49) 20.16,51.75 19.14,51.75 arc(18.89,52) 19.14,52.26 20.16,52.26 arc(20.41,52.51) 20.16,52.76 19.14,52.76 arc(18.89,53.02) 19.14,53.27 20.16,53.27 arc(20.41,53.53) 20.16,53.78 19.14,53.78 arc(18.89,54.03) 19.14,54.29 20.16,54.29 arc(20.34,54.36) 20.41,54.54 20.41,54.86 16.68,58.6 16.68,59.39 v1(17.36,60.07)
  Bottom Layer w0.203: 12.59,59.69 16.98,59.69 v1(17.36,60.07)
ESP_USB_DN: length 36.8
  Top Layer w0.203: U17.6 24.33,17.38 v1(24.73,17.78) ; U9.41 v1(36.05,40.51)
  SINGAL w0.203: v1(36.05,40.51) 36.92,39.64 36.92,30.61 35.78,29.46 25.66,29.46 24.73,28.53 v1(24.73,17.78)
ESP_USB_DP: length 37
  Top Layer w0.203: v1(24.09,18.54) 23.83,18.28 U17.7 ; U9.40 v1(35.2,40.51)
  SINGAL w0.203: v1(35.2,40.51) 36.41,39.3 36.41,30.86 35.53,29.97 25.37,29.97 24.09,28.7 v1(24.09,18.54)
GBAT: length 8.1
  Bottom Layer w0.203: U14.6 41.11,30.85 R34.1 41.82,30.53 43.65,28.7 CN2.3
LCD_LEDK: length 10.2
  Top Layer w0.203: v1(33.78,47.12) 37.69,51.03 v1(39.72,51.03)
  Bottom Layer w0.203: v1(39.72,51.03) 39.74,51.03 R40.2 ; v1(33.78,47.12) 34.78,47.12 U16.5
MOTOR_OUT_N: length 9.9
  Bottom Layer w0.203: U11.9 38.33,15.76 38.06,15.49
  Bottom Layer w0.508: CN3.2 42.02,10.39 38.06,14.35 38.06,15.49
MOTOR_OUT_P: length 15.7
  Bottom Layer w0.203: 38.03,16.75 39.4,16.75
  Bottom Layer w0.508: 38.03,16.75 38.02,16.76 36.8,16.76 36.29,16.25 36.29,13.83 42.23,7.89 CN3.1
PWR_3V3_EN: length 26.2
  Top Layer w0.203: R5.2 39.75,29.1 U4.1 39.75,27.21 v1(39.46,26.92)
  Bottom Layer w0.203: 26.51,22.86 U6.5 36.41,22.86 39.34,19.94 40.35,19.94 40.86,20.45 40.86,22.35 39.46,23.75 v1(39.46,26.92)
SGM7227_EN#: length 4.7
  Top Layer w0.203: U17.10 22.33,15.22 22.75,14.81 R21.2
TYPEC_USB_DN: length 2.6
  Top Layer w0.254: 23.83,11.88 23.83,11.06 24.54,10.35 D1.4
TYPEC_USB_DN_IN: length 18.3
  Top Layer w0.254: v1(24.53,5.99) 24.54,6 D1.3 ; USB1.A7 34.7,8.32 34.25,8.76 v1(33.7,8.76) USB1.B7
  SINGAL w0.254: v1(33.7,8.76) 33.7,5.92 32.86,5.08 27.87,5.08 arc(27.73,5.14) 27.67,5.27 arc(27.62,5.41) 27.48,5.46 27.36,5.46 arc(27.22,5.41) 27.17,5.27 arc(27.11,5.14) 26.98,5.08 26.85,5.08 arc(26.71,5.14) 26.66,5.27 arc(26.6,5.41) 26.47,5.46 26.34,5.46 arc(26.21,5.41) 26.15,5.27 arc(26.09,5.14) 25.96,5.08 25.44,5.08 v1(24.53,5.99)
TYPEC_USB_DP: length 2.6
  Top Layer w0.254: 22.64,9.53 22.64,10.35 23.33,11.05 23.33,11.88
TYPEC_USB_DP_IN: length 18.4
  Top Layer w0.254: v1(22.62,6.07) 22.64,6.09 22.64,7.23 ; USB1.B6 v1(35.2,6.1) 34.64,6.1 34.2,6.53 USB1.A6
  SINGAL w0.254: v1(35.2,6.1) 33.67,4.57 24.12,4.57 v1(22.62,6.07)
$2N13: length 5
  Top Layer w0.203: C11.1 32.26,17.23 32.6,16.89 33.37,16.89 34.94,15.32 U3.21
$2N16: length 23.4
  Top Layer w0.203: U3.22 34.3,14.82 34.14,14.97 ; C9.1 33,15.86 32.1,16.76 31.72,16.76 31.21,17.27 v1(31.21,17.78) ; R13.1 v1(44.8,16.45)
  Top Layer w0.508: C9.1 33.37,15.75 34.14,14.97
  Bottom Layer w0.203: v1(44.8,16.45) 44.8,17.14 44.16,17.78 39.69,17.78 38.17,19.3 32.73,19.3 v1(31.21,17.78)
$2N19: length 2.8
  Top Layer w0.203: U3.10 42.68,15.32 R9.2
$2N86: length 3.3
  Top Layer w0.203: R4.1 R3.2 40.31,26.16 U4.5
$2N133: length 1.8
  Bottom Layer w0.203: R33.1 38.95,31.29 U14.8
$2N135: length 1.4
  Bottom Layer w0.203: 39.72,29.67 41.11,29.67
$2N157: length 5
  Bottom Layer w0.203: U14.10 36.42,32.01 C61.1 35.53,31.13 35.53,29.72 35.83,29.41 36.16,29.41
$3N1: length 11.9
  Top Layer w0.203: C32.2 3.66,35.03 X1.1 4.36,33.4 8.47,33.4 10.05,31.82 U2.36
$3N2: length 8.4
  Top Layer w0.203: C33.1 4.92,32.34 X1.3 8.75,32.36 9.65,31.46 U2.37
$3N20: length 4.8
  Top Layer w0.203: C19.1 C18.2 5.01,26.16 U2.9
$3N22: length 7.9
  Top Layer w0.203: C25.2 17.11,23.2 17.11,24.13 16.73,24.51 15.46,24.51 14.95,25.02 C24.2 13.75,26.56 U2.23
$3N23: length 4.2
  Top Layer w0.203: 15.04,22.22 14.89,22.22 U2.20
$3N24: length 2.4
  Top Layer w0.203: C24.1 14.44,26.96 U2.24
$3N25: length 1.8
  Top Layer w0.203: U2.18 11.25,24.31 C22.1
$3N26: length 3.1
  Top Layer w0.203: 15.04,23.88 14.63,23.88 U2.21
$3N29: length 2.8
  Top Layer w0.203: U2.10 7.75,24.46 C20.1
$3N30: length 2
  Top Layer w0.203: C20.2 8.45,24.07 U2.11
$3N32: length 3
  Top Layer w0.203: C18.1 5.21,27.36 U2.6
$3N34: length 5.2
  Top Layer w0.203: U2.5 6.39,27.76 5.75,28.4 3.89,28.4 C8.1
$3N63: length 1.6
  Top Layer w0.203: U7.7 U7.8 15.05,39.16 R17.1
$3N69: length 16.2
  Top Layer w0.203: 9.65,23.91 U2.14
  Top Layer w0.508: 9.54,23.8 9.54,15.57 10.51,14.6 10.51,12.19 9.24,10.93 CN1.3
$3N70: length 20
  Top Layer w0.203: 10.58,23.62 10.45,23.75 U2.16
  Top Layer w0.508: 10.58,23.87 10.58,15.93 13.17,13.33 13.17,9.21 CN1.6
$5N6: length 1.8
  Bottom Layer w0.203: 34.7,15.26 34.68,15.24 32.9,15.24
$5N15: length 8.9
  Bottom Layer w0.203: U11.6 40.46,17.26 40.48,17.27 ; 39.4,15.26 40.35,15.26
  Bottom Layer w0.508: 42.7,15.24 41.15,15.24 C5.2 41.06,15.26 40.35,15.26 ; 42.7,15.24 42.7,14.73 ; 42.7,15.24 42.7,16.83 42.26,17.27 40.48,17.27
$6N45: length 6.5
  Top Layer w0.203: R32.2 40.91,5.08 37.3,5.08 36.2,6.19 USB1.B5
$6N46: length 12.5
  Top Layer w0.203: USB1.A5 33.2,5.12 34.13,4.19 41.75,4.19 42.51,4.95 R31.2
$6N67: length 1.6
  Top Layer w0.203: U12.6 26.35,34.79 C38.1
$7N55: length 1.5
  Bottom Layer w0.203: U1.9 32.93,30.62 C54.1

## Copper pours and planes (outline as drawn; the poured copper is in the pictures)
GND on Top Layer: -15.4,84.58 67.4,84.58 67.4,-26.29 -15.4,-26.29
GND on Bottom Layer: -13.37,84.58 62.32,84.58 62.32,-15.37 -13.37,-15.37
GND on SINGAL: -99.35,91.19 24.35,91.19 24.35,-28.7 -99.35,-28.7
VBAT on Top Layer: 39.2,21.17 40.48,21.17 40.48,16.66 39.2,16.66
VBAT on Top Layer: 38.71,21.88 44.54,21.88 44.54,19.81 38.71,19.81
VBAT on Top Layer: 38.71,21.88 40.49,21.88 40.49,16.67 38.71,16.67
VBUS_5V on Top Layer: 31.79,13.47 37.12,13.47 37.12,6.86 31.79,6.86
VCC on Top Layer: 37.22,21.54 38.48,21.54 38.48,16.66 37.22,16.66
VCC on Top Layer: 31.03,21.81 38.47,21.81 38.47,19.96 31.03,19.96
VCC_3V3 on Top Layer: 34.13,31.86 35.4,31.86 35.4,26.77 34.13,26.77
VCC_LCD_BG on Top Layer: 29.01,14.44 36.48,14.44 36.48,13 29.01,13
(no net) on Bottom Layer: 34.76,19.18 36.41,19.18 36.41,16.38 35.53,16.38 34.76,18.16
(no net) on Bottom Layer: 36.59,16.38 36.59,20.14 37.86,20.14 37.86,17.98 37.43,17.47 37.43,16.38
GBAT on Top Layer: 42.51,27.94 44.48,27.94 44.48,25.01 42.51,25.01
LCD_LEDA on Bottom Layer: 33.37,54.79 38.14,54.79 38.14,50.11 33.37,50.11
LCD_LEDK on Bottom Layer: 39.97,55.04 41.81,55.04 41.81,51.56 39.97,51.56
$2N14 on Top Layer: 32.81,19.43 36.48,19.43 36.48,15.69 32.81,15.69
$2N14 on Top Layer: 29.03,19.43 34.08,19.43 34.08,16.71 29.03,16.71
$2N84 on Top Layer: 35.78,28.96 38.22,28.96 38.22,26.9 35.78,26.9
$4N41 on Bottom Layer: 31.59,51.89 32.86,51.89 32.86,48.7 31.59,48.7
